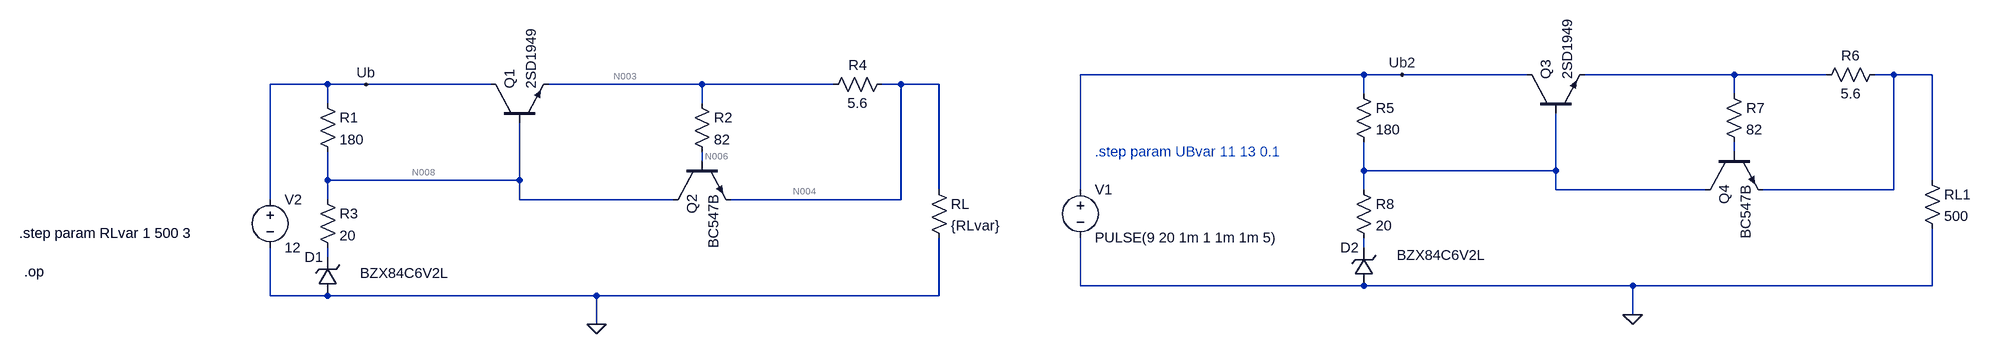
[diagram p0: schematic SerTrTr.asc]
SerTrTr.asc, the LTspice schematic file:
Version 4
SHEET 1 2920 680
WIRE 1744 -48 1168 -48
WIRE 1808 -48 1744 -48
WIRE 2016 -48 1808 -48
WIRE 2368 -48 2112 -48
WIRE 2624 -48 2368 -48
WIRE 2736 -48 2704 -48
WIRE 2800 -48 2736 -48
WIRE -240 -32 -336 -32
WIRE -176 -32 -240 -32
WIRE 32 -32 -176 -32
WIRE 384 -32 128 -32
WIRE 640 -32 384 -32
WIRE 752 -32 720 -32
WIRE 816 -32 752 -32
WIRE 1744 -16 1744 -48
WIRE 2368 -16 2368 -48
WIRE -240 0 -240 -32
WIRE 384 0 384 -32
WIRE 2368 80 2368 64
WIRE 384 96 384 80
WIRE 1744 112 1744 64
WIRE 2064 112 2064 16
WIRE 2064 112 1744 112
WIRE -240 128 -240 80
WIRE 80 128 80 32
WIRE 80 128 -240 128
WIRE 2800 128 2800 -48
WIRE 816 144 816 -32
WIRE 1168 144 1168 -48
WIRE 1744 144 1744 112
WIRE 2064 144 2064 112
WIRE 2320 144 2064 144
WIRE 2736 144 2736 -48
WIRE 2736 144 2416 144
WIRE -336 160 -336 -32
WIRE -240 160 -240 128
WIRE 80 160 80 128
WIRE 336 160 80 160
WIRE 752 160 752 -32
WIRE 752 160 432 160
WIRE 1744 240 1744 224
WIRE -240 256 -240 240
WIRE 1168 304 1168 224
WIRE 1744 304 1168 304
WIRE 2192 304 1744 304
WIRE 2800 304 2800 208
WIRE 2800 304 2192 304
WIRE -336 320 -336 240
WIRE -240 320 -336 320
WIRE 208 320 -240 320
WIRE 816 320 816 224
WIRE 816 320 208 320
WIRE 2192 352 2192 304
WIRE 208 368 208 320
FLAG 208 368 0
FLAG -176 -32 Ub
FLAG 2192 352 0
FLAG 1808 -48 Ub2
SYMBOL voltage -336 144 R0
WINDOW 123 0 0 Left 2
WINDOW 39 0 0 Left 2
SYMATTR InstName V2
SYMATTR Value 12
SYMBOL res -256 -16 R0
SYMATTR InstName R1
SYMATTR Value 180
SYMBOL npn 32 32 R270
SYMATTR InstName Q1
SYMATTR Value 2SD1949
SYMBOL res 736 -48 R90
WINDOW 0 0 56 VBottom 2
WINDOW 3 32 56 VTop 2
SYMATTR InstName R4
SYMATTR Value 5.6
SYMBOL npn 336 96 M90
SYMATTR InstName Q2
SYMATTR Value BC547B
SYMBOL res 800 128 R0
SYMATTR InstName RL
SYMATTR Value {RLvar}
SYMBOL zener -224 320 R180
WINDOW 0 24 64 Left 2
WINDOW 3 -185 37 Left 2
SYMATTR InstName D1
SYMATTR Value BZX84C6V2L
SYMBOL res 368 -16 R0
SYMATTR InstName R2
SYMATTR Value 82
SYMBOL res -256 144 R0
SYMATTR InstName R3
SYMATTR Value 20
SYMBOL voltage 1168 128 R0
WINDOW 123 0 0 Left 2
WINDOW 39 0 0 Left 2
SYMATTR InstName V1
SYMATTR Value PULSE(9 20 1m 1 1m 1m 5)
SYMBOL res 1728 -32 R0
SYMATTR InstName R5
SYMATTR Value 180
SYMBOL npn 2016 16 R270
SYMATTR InstName Q3
SYMATTR Value 2SD1949
SYMBOL res 2720 -64 R90
WINDOW 0 0 56 VBottom 2
WINDOW 3 32 56 VTop 2
SYMATTR InstName R6
SYMATTR Value 5.6
SYMBOL npn 2320 80 M90
SYMATTR InstName Q4
SYMATTR Value BC547B
SYMBOL res 2784 112 R0
SYMATTR InstName RL1
SYMATTR Value 500
SYMBOL zener 1760 304 R180
WINDOW 0 24 64 Left 2
WINDOW 3 -186 51 Left 2
SYMATTR InstName D2
SYMATTR Value BZX84C6V2L
SYMBOL res 2352 -32 R0
SYMATTR InstName R7
SYMATTR Value 82
SYMBOL res 1728 128 R0
SYMATTR InstName R8
SYMATTR Value 20
TEXT -768 280 Left 2 !.op
TEXT -776 216 Left 2 !.step param RLvar 1 500 3
TEXT 1192 80 Left 2 ;.step param UBvar 11 13 0.1

The netlist it stands for:
* SerTrTr.asc
V2 Ub 0 12
R1 Ub N008 180
Q1 Ub N008 N003 0 2SD1949
R4 N004 N003 5.6
Q2 N008 N006 N004 0 BC547B
RL N004 0 {RLvar}
D1 0 N010 BZX84C6V2L
R2 N003 N006 82
R3 N008 N010 20
V1 Ub2 0 PULSE(9 20 1m 1 1m 1m 5)
R5 Ub2 N007 180
Q3 Ub2 N007 N001 0 2SD1949
R6 N002 N001 5.6
Q4 N007 N005 N002 0 BC547B
RL1 N002 0 500
D2 0 N009 BZX84C6V2L
R7 N001 N005 82
R8 N007 N009 20
.model D D
.lib standard.dio
.model NPN NPN
.model PNP PNP
.lib standard.bjt
.op
.step param RLvar 1 500 3
* .step param UBvar 11 13 0.1
.backanno
.end

* Results of the author's LTspice run, read from the files saved beside the schematic
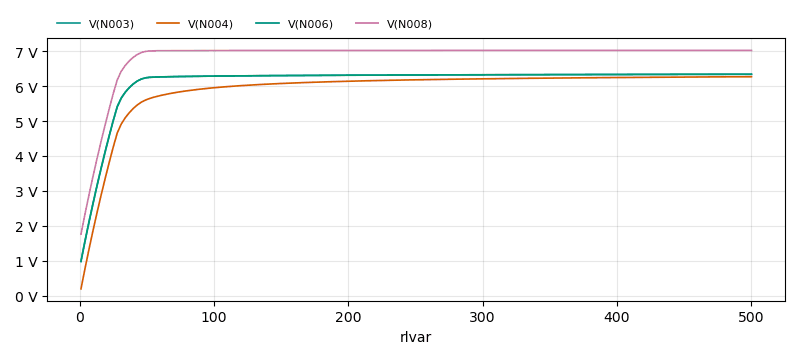
[diagram p1: Operating Point of SerTrTr.asc, plotted from the saved traces]
* Operating Point, 1 run:
*   V(N003): 1.001 V at rlvar=1 , 6.34 V at rlvar=500 , min 1.001 V, max 6.34 V
*   V(N004): 199.5 mV at rlvar=1 , 6.27 V at rlvar=500 , min 199.5 mV, max 6.27 V
*   V(N006): 978.3 mV at rlvar=1 , 6.34 V at rlvar=500 , min 978.3 mV, max 6.34 V
*   V(N008): 1.767 V at rlvar=1 , 7.023 V at rlvar=500 , min 1.767 V, max 7.023 V
* From the log:
*   Semiconductor Device Operating Points:
*                           --- Diodes ---
*   Name:      d2          d1
*   Model: bzx84c6v2l  bzx84c6v2l
*   Id:     -1.29e-02   -1.50e-09
*   Vd:     -6.41e+00   -1.77e+00
*   Req:     6.01e+00    1.00e+12
*   CAP:     6.80e-11    1.11e-10
*                           --- Bipolar Transistors ---
*   Name:       q4          q2          q3          q1
*   Model:    bc547b      bc547b      2sd1949     2sd1949
*   Ib:      -6.64e-13    2.76e-04    6.10e-05    7.95e-04
*   Ic:       1.05e-12    5.61e-02    1.18e-02    1.43e-01
*   Vbe:      6.62e-02    7.79e-01    6.82e-01    7.66e-01
*   Vbc:     -6.82e-01   -7.89e-01   -2.34e+00   -1.02e+01
*   Vce:      7.49e-01    1.57e+00    3.02e+00    1.10e+01
*   BetaDC:  -1.59e+00    2.03e+02    1.93e+02    1.79e+02
*   Gm:       1.17e-11    1.66e+00    4.47e-01    4.47e+00
*   Rpi:      6.63e+11    9.46e+01    4.35e+02    3.30e+01
*   Rx:       1.00e+00    1.00e+00    3.80e+00    3.80e+00
*   Ro:       2.08e+14    1.11e+03    8.64e+03    7.68e+02
*   Cbe:      1.41e-11    3.11e-09    1.58e-10    9.44e-09
*   Cbc:      1.72e-12    1.69e-12    8.05e-12    4.96e-12
*   Cjs:      0.00e+00    0.00e+00    0.00e+00    0.00e+00
*   BetaAC:   7.77e+00    1.57e+02    1.95e+02    1.47e+02
*   Cbx:      1.06e-12    1.04e-12    0.00e+00    0.00e+00
*   Ft:       1.10e-01    8.46e+07    4.27e+08    7.54e+07